# Altium project caton-pcb.PrjPcb (part 2 of 2)

## Sheet caton-ads1299.SchDoc
size A4; SheetNumber: 2; SheetTotal: 2
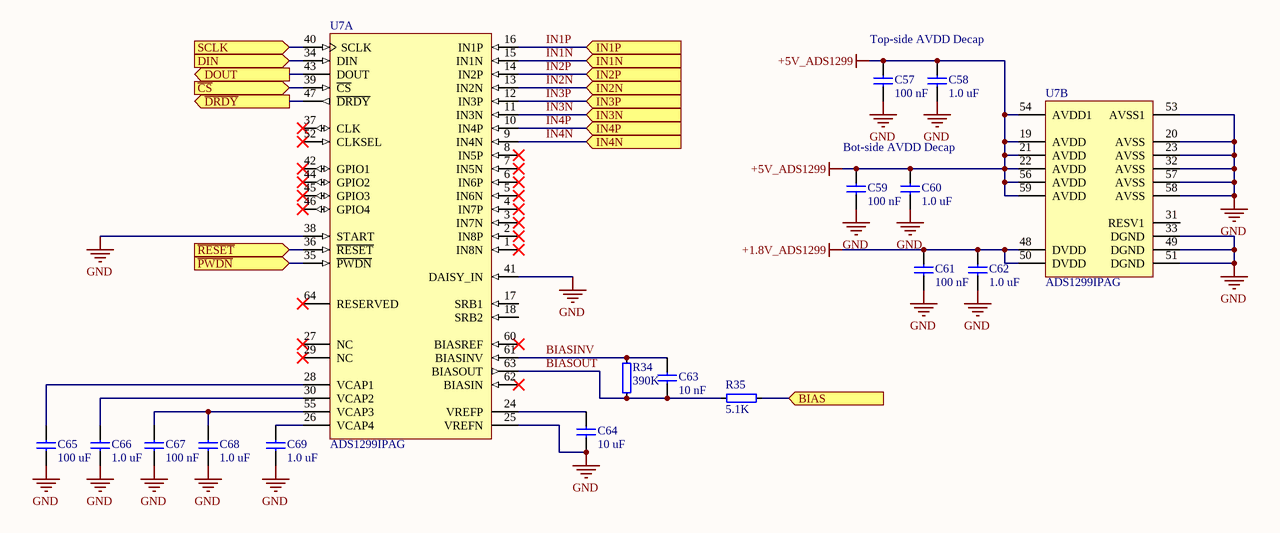
[diagram p2: caton-ads1299.SchDoc]

### Parts
C57  100 nF  [0402]
C58  1.0 uF  [0402]
C59  100 nF  [0402]
C60  1.0 uF  [0402]
C61  100 nF  [0402]
C62  1.0 uF  [0402]
C63  10 nF  [0402]
C64  10 uF  [0402]
C65  100 uF  [0805]
C66  1.0 uF  [0402]
C67  100 nF  [0402]
C68  1.0 uF  [0402]
C69  1.0 uF  [0402]
R34  390K  [0402]
R35  5.1K  [0402]
U7  ADS1299IPAG  [PAG0064A_L]  (parts A,B of 2)

### Ports
BIAS (in), DIN (in), DOUT (out), IN1N (in), IN1P (in), IN2N (in), IN2P (in), IN3N (in), IN3P (in), IN4N (in), IN4P (in), SCLK (in), ~{CS} (in), ~{DRDY} (out), ~{PWDN} (in), ~{RESET} (in)

### Nets
+1.8V_ADS1299: C61.1 C62.1 U7.48(DVDD) U7.50(DVDD)
+5V_ADS1299: C57.1 C58.1 C59.1 C60.1 U7.19(AVDD) U7.21(AVDD) U7.22(AVDD) U7.54(AVDD1) U7.56(AVDD) U7.59(AVDD)
GND: C57.2 C58.2 C59.2 C60.2 C61.2 C62.2 C64.2 C65.2 C66.2 C67.2 C68.2 C69.2 U7.20(AVSS) U7.23(AVSS) U7.25(VREFN) U7.32(AVSS) U7.33(DGND) U7.38(START) U7.41(DAISY_IN) U7.49(DGND) U7.51(DGND) U7.53(AVSS1) U7.57(AVSS) U7.58(AVSS)
BIASINV: C63.1 R34.2 U7.61(BIASINV)
BIASOUT: C63.2 R34.1 R35.2 U7.63(BIASOUT)
IN1N: U7.15(IN1N) ; port IN1N
IN1P: U7.16(IN1P) ; port IN1P
IN2N: U7.13(IN2N) ; port IN2N
IN2P: U7.14(IN2P) ; port IN2P
IN3N: U7.11(IN3N) ; port IN3N
IN3P: U7.12(IN3P) ; port IN3P
IN4N: U7.9(IN4N) ; port IN4N
IN4P: U7.10(IN4P) ; port IN4P
NetC64_1: C64.1 U7.24(VREFP)
NetC65_1: C65.1 U7.28(VCAP1)
NetC66_1: C66.1 U7.30(VCAP2)
NetC67_1: C67.1 C68.1 U7.55(VCAP3)
NetC69_1: C69.1 U7.26(VCAP4)
NetR35_1: R35.1 ; port BIAS
NetU7_34: U7.34(DIN) ; port DIN
NetU7_35: U7.35(~{PWDN}) ; port ~{PWDN}
NetU7_36: U7.36(~{RESET}) ; port ~{RESET}
NetU7_39: U7.39(~{CS}) ; port ~{CS}
NetU7_40: U7.40(SCLK) ; port SCLK
NetU7_43: U7.43(DOUT) ; port DOUT
NetU7_47: U7.47(~{DRDY}) ; port ~{DRDY}

Not connected (* = marked no-connect by the designer): U7 1(IN8N)* 2(IN8P)* 3(IN7N)* 4(IN7P)* 5(IN6N)* 6(IN6P)* 7(IN5N)* 8(IN5P)* 17(SRB1) 18(SRB2) 27(NC)* 29(NC)* 31(RESV1) 37(CLK)* 42(GPIO1)* 44(GPIO2)* 45(GPIO3)* 46(GPIO4)* 52(CLKSEL)* 60(BIASREF)* 62(BIASIN)* 64(RESERVED)*

### Notes on the sheet
- Top-side AVDD Decap
- Bot-side AVDD Decap

### Library data of the parts
C57-C64 C66-C69 = C0402: Capacitor, 0402, X5R, ±20%; Part Number: C0402-4µ7; Manufacturer: N.A.; Part number IPS: 00000001251, 00000007165; Note: 10V; Artikkelnr Noca: 20039482; Pad Count: 2; Manufacturer Part Number: N.A.; LatestRevisionDate: 2017-11-09; Published: 2009-05-08; Footprint Doc: 0402; ComponentLink1Description: Datasheet; ComponentLink1URL: N.A.; ComponentLink2Description: Supplier link; ComponentLink2URL: N.A.; HelpURL: N.A.; Supplier 1: Digi-Key; Supplier Part Number 1: 490-13252-1-ND; Supplier 2: N.A.; Supplier Part Number 2: N.A.; PartId: 100200193; Component Class: Capacitors; Author: rsk; Part number Norautron: N.A.
  C57 C59 C61 C67: Value: 100 nF
  C58 C60 C62 C66 C68 C69: Value: 1.0 uF
  C63: Value: 10 nF
  C64: Value: 10 uF
C65 = C0805: Capacitor, 0805; Part Number: C0603-4µ7; Manufacturer: N.A.; Part number IPS: 00000007783; Note: 6.3V; Artikkelnr Noca: 20069060; Pad Count: 2; Manufacturer Part Number: N.A.; LatestRevisionDate: 2009-11-23; Published: 2009-05-08; Value: 100 uF; Footprint Doc: 0603; ComponentLink1Description: Datasheet; ComponentLink1URL: N.A.; ComponentLink2Description: Supplier link; ComponentLink2URL: N.A.; HelpURL: N.A.; Supplier 1: N.A.; Supplier Part Number 1: N.A.; Supplier 2: N.A.; Supplier Part Number 2: N.A.; PartId: 100200274; Component Class: Capacitors; Author: rsk; Part number Norautron: N.A.
R34 R35 = R0402: Resistor, 0402, ±1%, 0.05W; Part Number: R0201-10k; Manufacturer: N.A.; Part number IPS: 00000001255; Note: Chip Res 1%; Pad Count: 2; Manufacturer Part Number: N.A.; LatestRevisionDate: 2014-11-13; Published: 2014-11-13; Artikkelnr Noca: N.A.; Footprint Doc: 0201; ComponentLink1Description: Datasheet; ComponentLink1URL: N.A.; ComponentLink2Description: Supplier link; ComponentLink2URL: N.A.; HelpURL: N.A.; Supplier 1: N.A.; Supplier Part Number 1: N.A.; Supplier 2: N.A.; Supplier Part Number 2: N.A.; PartId: 100100065; Component Class: Resistors; Author: rsk; Part number Norautron: N.A.
  R34: Value: 390K
  R35: Value: 5.1K
U7 = CMP-0841-00002-2: Low-Noise, 8-Channel, 24-Bit Analog Front-End for Biopotential Measurement, 16 KSPS, -40 to 85 degC, 64-Pin PQFP (PAG-64), RoHS, Tube; Manufacturer: Texas Instruments; Architecture: Delta-Sigma; Reference Mode: Int, Ext; # Input Channels: 8; Resolution (Bits): 24; Sample Rate (max) (KSPS): 16; Interface: Serial SPI; Packing: PAG0064A; PackageVersion: 4040282/C; PackageReference: PAG-64; ComponentLink3Description: Package Specification; DatasheetVersion: SBAS499A; ComponentLink1Description: Manufacturer URL; ComponentLink2Description: Datasheet; PackageDescription: 64-Pin Plastic Quad Flatpack, Body 10 x 10 mm, Pitch 0.5 mm; RoHS: TRUE; Operating Temperature Range (C): -40 to 85; ComponentLink3URL: http://www.ti.com/lit/ml/mtqf006a/mtqf006a.pdf; ComponentLink1URL: http://www.ti.com/; ComponentLink2URL: http://www.ti.com/lit/ds/symlink/ads1299.pdf; PartNumber: ADS1299IPAG; Mounting Technology: Surface Mount

## Nets that join several sheets
+1.8V_ADS1299: caton-top (10 pins), caton-ads1299 (C61.1 C62.1 U7.48 U7.50)
+5V_ADS1299: caton-top (14 pins), caton-ads1299 (10 pins)
GND: caton-nrf52840 (47 pins), caton-top (98 pins), caton-ads1299 (24 pins)